# EAGLE design reprap_modular_electronics (EAGLE 5.11)
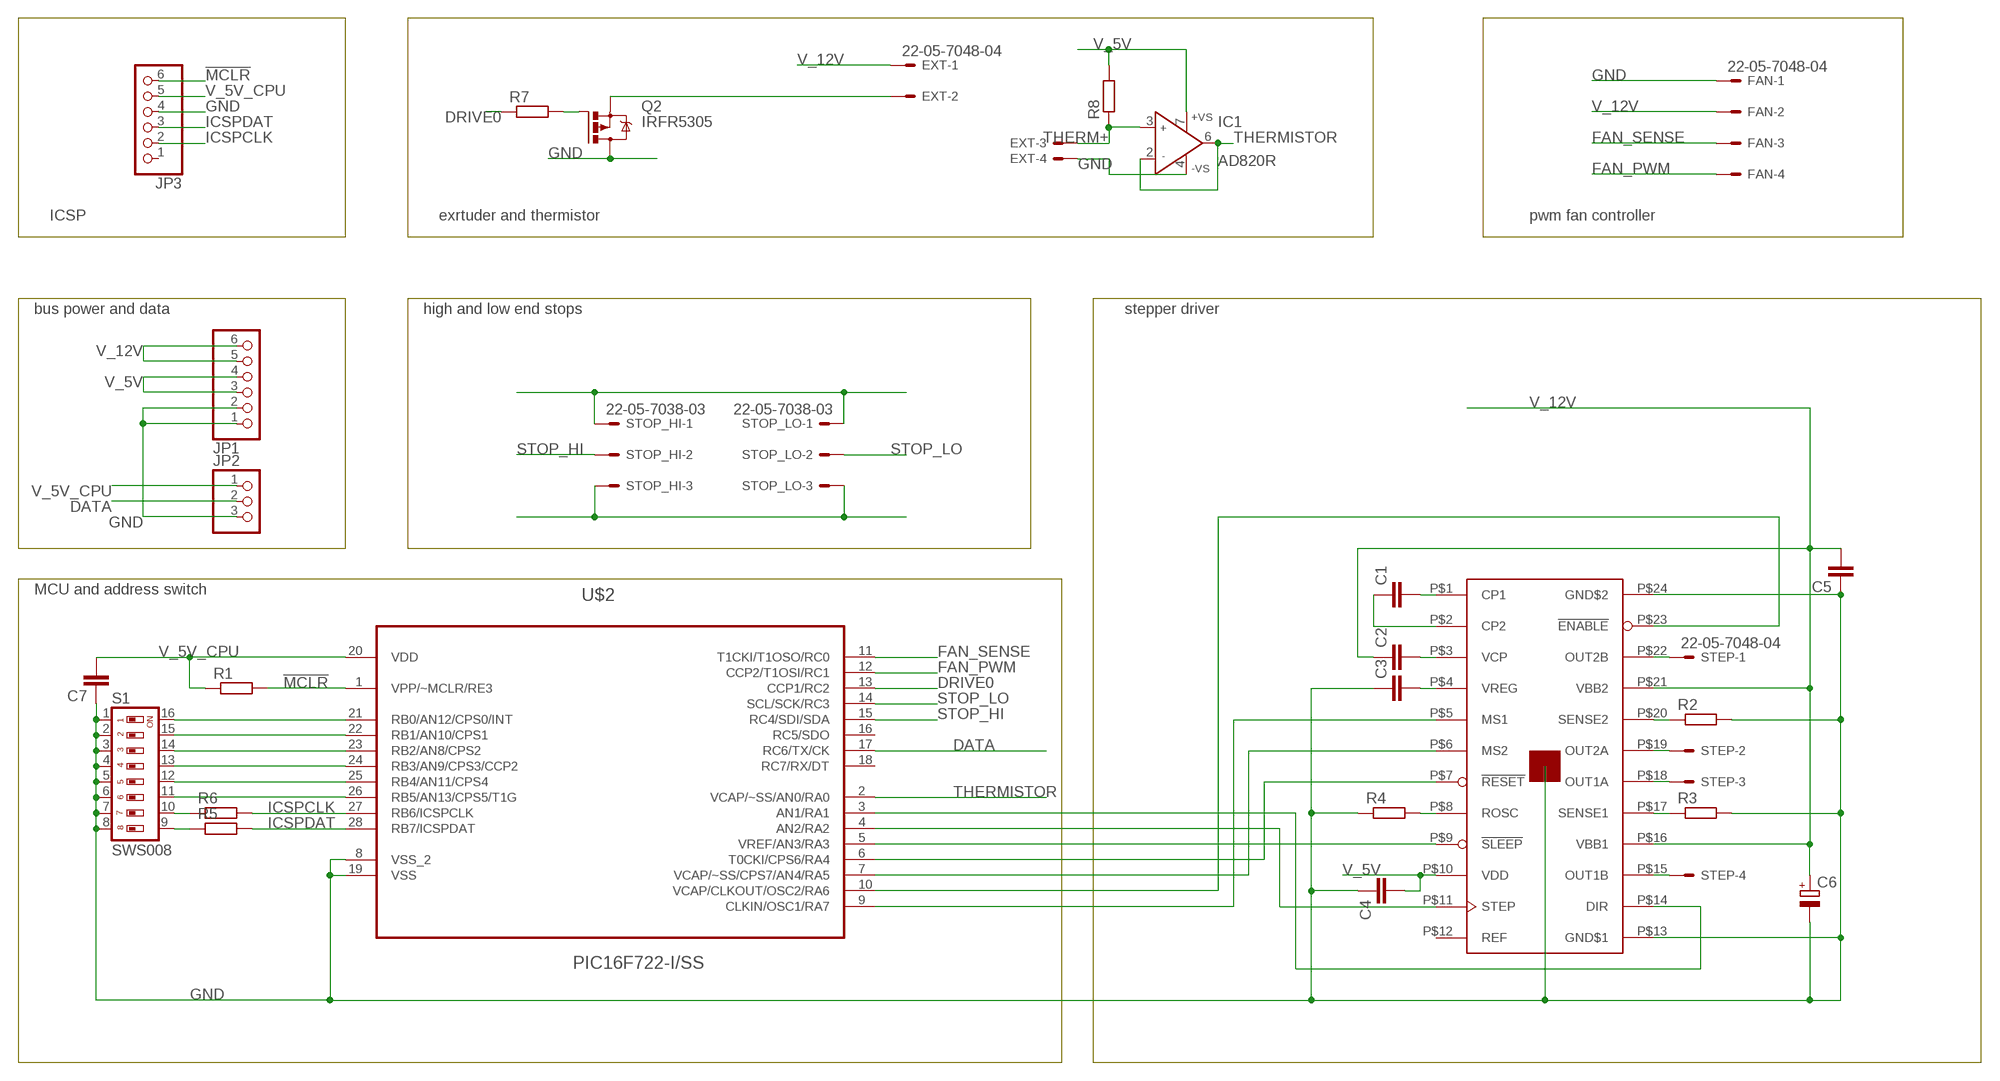
[diagram p0: schematic, sheet 1]

## Parts
C1  C-EUC0603K  [C0603K]
C2  C-EUC0603K  [C0603K]
C3  C-EUC0603K  [C0603K]
C4  C-EUC0603K  [C0603K]
C5  C-EUC0603K  [C0603K]
C6  CPOL-EU153CLV-0505  [153CLV-0505]
C7  C-EUC0603K  [C0603K]
EXT  22-05-7048-04  [7395-04]
FAN  22-05-7048-04  [7395-04]
IC1  AD820R  [SO8]
JP1  PINHD-1X6/90  [1X06/90]
JP2  PINHD-1X3/90  [1X03/90]
JP3  PINHD-1X6/90  [1X06/90]
Q2  IRFR5305  [D-PAK_TO252AA]
R1  R-EU_R0603  [R0603]
R2  R-EU_R0805  [R0805]
R3  R-EU_R0805  [R0805]
R4  R-EU_R0603  [R0603]
R5  R-EU_R0603  [R0603]
R6  R-EU_R0603  [R0603]
R7  R-EU_R0603  [R0603]
R8  R-EU_R0603  [R0603]
S1  SWS008  [SMS-008]
STEP  22-05-7048-04  [7395-04]
STOP_HI  22-05-7038-03  [7395-03]
STOP_LO  22-05-7038-03  [7395-03]
U$1  A4982  [TSSOP24]
U$2  PIC16F722-I/SS  [SOP65P780X200-28N]

## Nets
!ENABLE: U$1.P$23(!ENABLE) U$2.10(VCAP/CLKOUT/OSC2/RA6)
!MCLR: JP3.6 R1.2 U$2.1(VPP/~MCLR/RE3)
!RESET: U$1.P$7(!RESET) U$2.6(T0CKI/CPS6/RA4)
!SLEEP: U$1.P$9(!SLEEP) U$2.5(VREF/AN3/RA3)
DATA: JP2.2 U$2.17(RC6/TX/CK)
DIR: U$1.P$14(DIR) U$2.3(AN1/RA1)
DRIVE0: R7.1 U$2.13(CCP1/RC2)
FAN_PWM: FAN.4 U$2.12(CCP2/T1OSI/RC1)
FAN_SENSE: FAN.3 U$2.11(T1CKI/T1OSO/RC0)
GND: C3.1 C4.1 C5.1 C6.- C7.1 EXT.4 FAN.1 IC1.4(-VS) JP1.1 JP1.2 JP2.3 JP3.4 Q2.4(D) R2.2 R3.2 R4.1 S1.1 S1.2 S1.3 S1.4 S1.5 S1.6 S1.7 S1.8 STOP_HI.3 STOP_LO.3 U$1.EP(GND$0) U$1.P$13(GND$1) U$1.P$24(GND$2) U$2.8(VSS_2) U$2.19(VSS)
ICSPCLK: JP3.2 R6.2 U$2.27(RB6/ICSPCLK)
ICSPDAT: JP3.3 R5.2 U$2.28(RB7/ICSPDAT)
MS2: U$1.P$6(MS2) U$2.7(VCAP/~SS/CPS7/AN4/RA5)
N$1: EXT.2 Q2.3(S)
N$2: U$1.P$5(MS1) U$2.9(CLKIN/OSC1/RA7)
N$8: STEP.1 U$1.P$22(OUT2B)
N$9: STEP.2 U$1.P$19(OUT2A)
N$10: STEP.3 U$1.P$18(OUT1A)
N$11: STEP.4 U$1.P$15(OUT1B)
N$12: R2.1 U$1.P$20(SENSE2)
N$13: R3.1 U$1.P$17(SENSE1)
N$14: C1.2 U$1.P$1(CP1)
N$15: C1.1 U$1.P$2(CP2)
N$16: C2.2 U$1.P$3(VCP)
N$17: C3.2 U$1.P$4(VREG)
N$18: R5.1 S1.9
N$19: R6.1 S1.10
N$20: R4.2 U$1.P$8(ROSC)
N$21: S1.16 U$2.21(RB0/AN12/CPS0/INT)
N$22: S1.15 U$2.22(RB1/AN10/CPS1)
N$23: S1.14 U$2.23(RB2/AN8/CPS2)
N$24: S1.13 U$2.24(RB3/AN9/CPS3/CCP2)
N$25: S1.12 U$2.25(RB4/AN11/CPS4)
N$26: S1.11 U$2.26(RB5/AN13/CPS5/T1G)
N$27: Q2.1(G) R7.2
STEP: U$1.P$11(STEP) U$2.4(AN2/RA2)
STOP_HI: STOP_HI.2 U$2.15(RC4/SDI/SDA)
STOP_LO: STOP_LO.2 U$2.14(SCL/SCK/RC3)
THERM+: EXT.3 IC1.3(IN+) R8.1
THERMISTOR: IC1.2(IN-) IC1.6(OUT) U$2.2(VCAP/~SS/AN0/RA0)
V_5V: C4.2 IC1.7(+VS) JP1.3 JP1.4 R8.2 STOP_HI.1 STOP_LO.1 U$1.P$10(VDD)
V_5V_CPU: C7.2 JP2.1 JP3.5 R1.1 U$2.20(VDD)
V_12V: C2.1 C5.2 C6.+ EXT.1 FAN.2 JP1.5 JP1.6 U$1.P$16(VBB1) U$1.P$21(VBB2)
Unconnected: JP3.1 U$1.P$12(REF) U$2.16(RC5/SDO) U$2.18(RC7/RX/DT)

## Notes on the sheet
- ICSP | exrtuder and thermistor | pwm fan controller
- bus power and data | high and low end stops | stepper driver
- MCU and address switch

## Library data of the parts
C1-C5 C7 = rcl:C-EU: CAPACITOR, European symbol
C6 = rcl:CPOL-EU: POLARIZED CAPACITOR, European symbol
EXT FAN STEP = con-molex:22-?-04: CONNECTOR wire to board 2.54 mm (.1 inch) pitch header; OC_FARNELL: unknown; OC_NEWARK: unknown
IC1 = analog-devices:AD820: Single-Supply, Rail-to-Rail, Low Power, FET Input Op Amp Source: http://www.analog.com/static/imported-files/data_sheets/AD820.pdf; OC_FARNELL: 1838867; OC_NEWARK: unknown
JP1 JP3 = pinhead:PINHD-1X6: PIN HEADER
JP2 = pinhead:PINHD-1X3: PIN HEADER
Q2 = transistor-power:IRF?5305: HEXFET Power MOSFET Source: http://www.irf.com/product-info/datasheets/data/irfr5305pbf.pdf
R1 R5-R8 = rcl:R-EU_: RESISTOR, European symbol
R2-R4 = resistor:R-EU_: RESISTOR, European symbol
S1 = smd-special:SWS008: SMD Dip Switch 8 pol.
STOP_HI STOP_LO = con-molex:22-?-03: CONNECTOR wire to board 2.54 mm (.1 inch) pitch header; OC_FARNELL: unknown; OC_NEWARK: unknown
U$1 = ics:A4982
U$2 = ics:PIC16F722-I/SS: 8-Bit CMOS Microcontrollers; MPN: PIC16F722-I/SS; OC_FARNELL: 1630147; OC_NEWARK: 54M4996; PACKAGE: SOP-28; SUPPLIER: Microchip

## Board
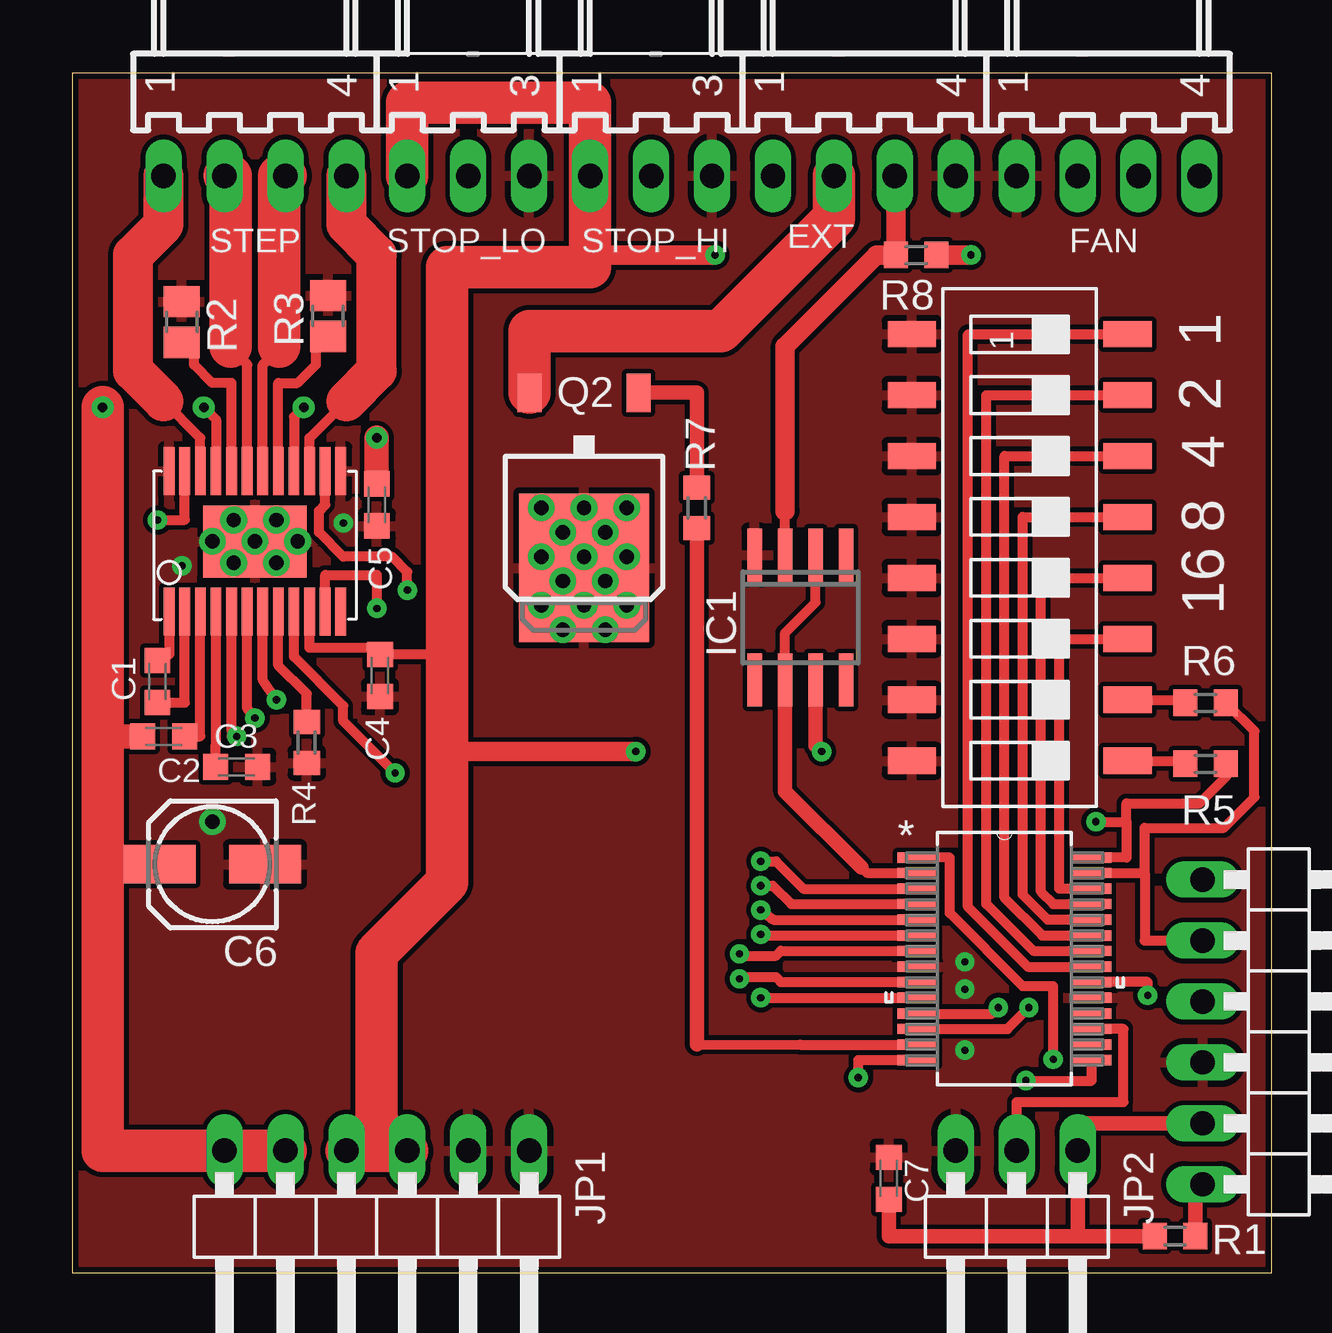
[diagram p1: board, top side]
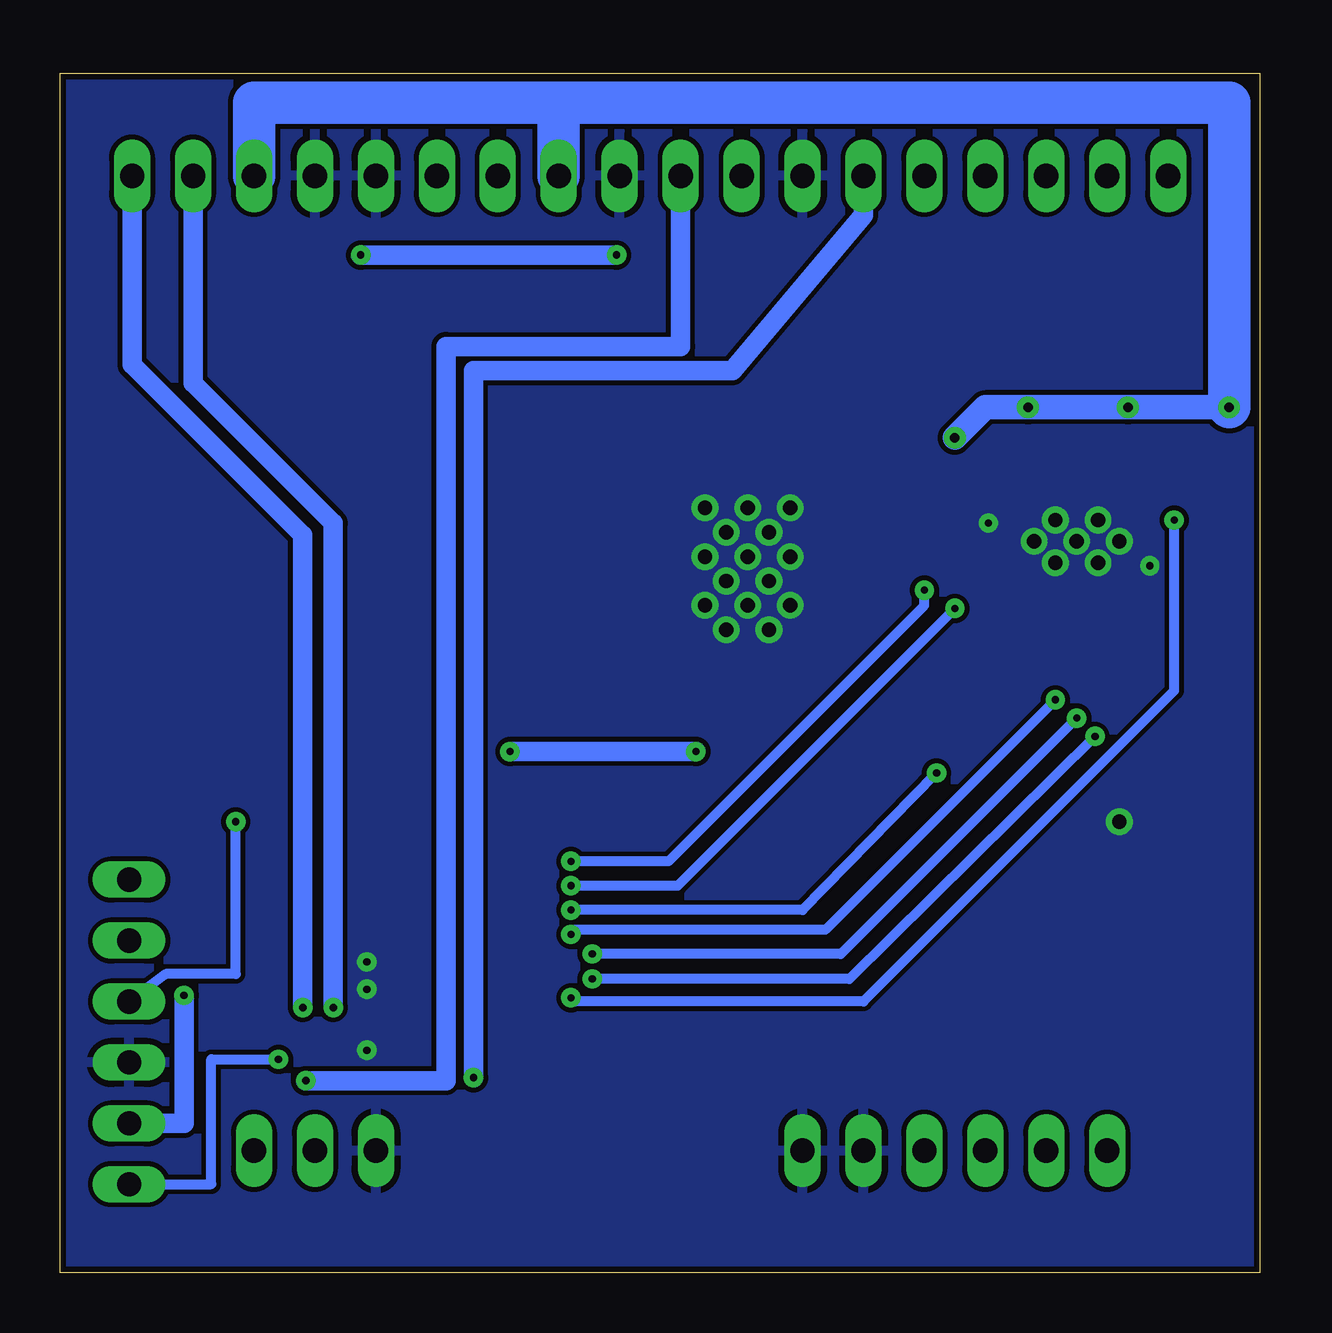
[diagram p2: board, bottom side, seen from below]

Size 50 x 50 mm. Coordinates in mm from the lower left corner, seen from the top.
Outline: 0,0 50,0 50,50 0,50 0,0
Copper layers (1*16): Top 0.035mm / dielectric 1.5mm / Bottom 0.035mm
Design rules "pcbtrain *": minimum track width 0.2mm, minimum drill 0.3mm, track to track 0.2mm, track to pad 0.2mm, pad to pad 0.2mm, via to via 0.2mm, smd to smd 0mil, copper to edge 10mil, drill to drill 0.2mm, minimum pad ring 10mil, minimum via ring 10mil, stop-mask expansion 0.125mm, vias tented up to drill 2mm, thermal gap 10mil

### Footprints (pad centres in the part's own frame; a part is rotated, then mirrored left to right if it is on the bottom)
C0603K = smd 1.05 x 1.08: 1 -0.875,0; 2 0.875,0
153CLV-0505 = smd 3 x 1.6: + 2.2,0; - -2.2,0
7395-04 = drill 1.016 long: 1 3.81,0; 2 1.27,0; 3 -1.27,0; 4 -3.81,0
SO8 = smd 0.6 x 2.2: 1 -1.905,-2.6; 2 -0.635,-2.6; 3 0.635,-2.6; 4 1.905,-2.6; 5 1.905,2.6; 6 0.635,2.6; 7 -0.635,2.6; 8 -1.905,2.6
1X06/90 = drill 1.016 long: 1 -6.35,-3.81; 2 -3.81,-3.81; 3 -1.27,-3.81; 4 1.27,-3.81; 5 3.81,-3.81; 6 6.35,-3.81
1X03/90 = drill 1.016 long: 1 -2.54,-3.81; 2 0,-3.81; 3 2.54,-3.81
D-PAK_TO252AA = smd 1 x 1.6: 1 -2.28,-4.8; 3 2.28,-4.8 | smd 5.4 x 6.2: 4 0,2.5
R0603 = smd 1 x 1.1: 1 -0.85,0; 2 0.85,0
R0805 = smd 1.3 x 1.5: 1 -0.85,0; 2 0.85,0
SMS-008 = smd 1.092 x 2.007: 1 -8.89,-4.496; 2 -6.35,-4.496; 3 -3.81,-4.496; 4 -1.27,-4.496; 5 1.27,-4.496; 6 3.81,-4.496; 7 6.35,-4.496; 8 8.89,-4.496; 9 8.89,4.496; 10 6.35,4.496; 11 3.81,4.496; 12 1.27,4.496; 13 -1.27,4.496; 14 -3.81,4.496; 15 -6.35,4.496; 16 -8.89,4.496
7395-03 = drill 1.016 long: 1 2.54,0; 2 0,0; 3 -2.54,0
TSSOP24 = smd 4.32 x 3: EP 0,0 | smd 0.45 x 2: P$1 -3.575,-2.925; P$2 -2.925,-2.925; P$3 -2.275,-2.925; P$4 -1.625,-2.925; P$5 -0.975,-2.925; P$6 -0.325,-2.925; P$7 0.325,-2.925; P$8 0.975,-2.925; P$9 1.625,-2.925; P$10 2.275,-2.925; P$11 2.925,-2.925; P$12 3.575,-2.925; P$13 3.575,2.925; P$14 2.925,2.925; P$15 2.275,2.925; P$16 1.625,2.925; P$17 0.975,2.925; P$18 0.325,2.925; P$19 -0.325,2.925; P$20 -0.975,2.925; P$21 -1.625,2.925; P$22 -2.275,2.925; P$23 -2.925,2.925; P$24 -3.575,2.925
SOP65P780X200-28N = smd 1.651 x 0.432: 1 -3.632,4.216; 2 -3.632,3.581; 3 -3.632,2.921; 4 -3.632,2.286; 5 -3.632,1.626; 6 -3.632,0.965; 7 -3.632,0.33; 8 -3.632,-0.33; 9 -3.632,-0.965; 10 -3.632,-1.626; 11 -3.632,-2.286; 12 -3.632,-2.921; 13 -3.632,-3.581; 14 -3.632,-4.216; 15 3.632,-4.216; 16 3.632,-3.581; 17 3.632,-2.921; 18 3.632,-2.286; 19 3.632,-1.626; 20 3.632,-0.965; 21 3.632,-0.33; 22 3.632,0.33; 23 3.632,0.965; 24 3.632,1.626; 25 3.632,2.286; 26 3.632,2.921; 27 3.632,3.581; 28 3.632,4.216

### Placement (x,y rotation side)
C1  3.56,24.64 90 top
C2  3.81,22.35 0 top
C3  6.86,21.08 180 top
C4  12.83,24.89 90 top
C5  12.7,32 90 top
C6  5.84,17.02 180 top
C7  34.04,3.94 270 top
EXT  33.02,45.72 180 top
FAN  43.18,45.72 180 top
IC1  30.35,27.3 180 top
JP1  12.7,1.27 180 top
JP2  39.37,1.27 180 top
JP3  50.93,10.03 270 top
Q2  21.34,31.88 180 top
R1  45.97,1.52 0 top
R2  4.57,39.62 90 top
R3  10.67,39.88 90 top
R4  9.78,22.1 90 top
R5  47.24,21.21 0 top
R6  47.24,23.75 0 top
R7  26.04,31.88 90 top
R8  35.18,42.42 0 top
S1  39.5,30.23 270 top
STEP  7.62,45.72 180 top
STOP_HI  24.13,45.72 180 top
STOP_LO  16.51,45.72 180 top
U$1  7.62,30.48 0 top
U$2  38.86,13.08 0 top

### Tracks (layer width: path | path; a pad name or v marks a point on that pad's centre or on a via)
!ENABLE  (via drill 0.3 pad 0.25)
  Top 0.406: U$1.P$23 4.7,31.37 v3.56,31.37 | v28.7,11.46 U$2.10
  Bottom 0.406: v28.7,11.46 28.55,11.3 16.51,11.3 3.56,24.26 v3.56,31.37
!MCLR  (via drill 0.3 pad 0.25)
  Top 0.406: U$2.1 36.58,17.3 36.58,14.99 39.62,11.94 40.89,11.94 v40.89,8.89
  Top 0.61: JP3.6 46.82,3.68 R1.2
  Bottom 0.406: v40.89,8.89 43.69,8.89 43.69,3.68 JP3.6
!RESET  (via drill 0.3 pad 0.25)
  Top 0.406: U$1.P$7 7.95,24.69 v8.51,23.88 | v28.7,14.1 28.75,14.05 U$2.6
  Bottom 0.406: v8.51,23.88 18.1,14.29 28.51,14.29 v28.7,14.1
!SLEEP  (via drill 0.3 pad 0.25)
  Top 0.406: U$1.P$9 9.24,25.68 11.3,23.62 11.3,22.99 v13.46,20.83 | v28.7,15.11 29.23,14.71 U$2.5
  Bottom 0.406: v13.46,20.83 19.05,15.11 v28.7,15.11
DATA
  Top 0.406: JP2.2 39.37,7.11 43.81,7.11 43.81,10.16 U$2.17
DIR  (via drill 0.3 pad 0.25)
  Top 0.406: U$1.P$14 10.54,32.01 10.29,31.75 10.29,30.86 11.3,29.84 13.34,29.84 13.97,29.21 v13.97,28.45 | v28.7,17.14 29.34,17.14 30.48,16 U$2.3
  Bottom 0.406: v13.97,28.45 13.97,27.81 24.64,17.14 v28.7,17.14
DRIVE0
  Top 0.406: 26.04,9.53 30.35,9.5 U$2.13
  Top 0.61: 26.04,9.53 R7.1
FAN_PWM  (via drill 0.3 pad 0.25)
  Top 0.406: U$2.12 38.99,10.16 v39.88,11.05
  Bottom 0.813: v39.88,11.05 39.88,30.73 46.99,37.85 FAN.4
FAN_SENSE  (via drill 0.3 pad 0.25)
  Top 0.406: U$2.11 38.35,10.79 v38.61,11.05
  Bottom 0.813: v38.61,11.05 38.61,31.24 44.45,37.08 FAN.3
GND  (via drill 0.3 pad 0.25, 0.6 pad 0.25)
  other vias: 7.62,30.48 6.73,31.37 8.51,31.37 8.51,29.59 9.4,30.48 5.84,30.48 6.73,29.59 5.84,18.8 37.21,11.81 37.21,9.27 37.21,12.95 11.3,31.24 4.57,29.46 21.34,31.88 20.45,30.86 22.23,30.86 21.34,29.84 20.45,28.83 22.23,28.83 23.11,29.84 23.11,31.88 19.56,31.88 19.56,29.84 19.56,27.81 21.34,27.81 23.11,27.81 22.23,26.8 20.45,26.8
  pour Bottom (rank 6): 0,50 50,50 50,0 0,0
  pour Top (rank 2): 0,0 50,0 50,50 0,50
ICSPCLK
  Top 0.406: R6.2 49.28,22.57 49.28,19.81 48.01,18.54 44.7,18.54 44.7,16.66 | U$2.27 44.7,16.66 | JP3.2 44.7,13.84 44.7,16.66
ICSPDAT  (via drill 0.3 pad 0.25)
  Top 0.406: R5.2 48.09,20.66 46.99,19.56 43.94,19.56 43.94,18.8 | U$2.28 43.94,17.3 43.94,18.8 | v42.67,18.8 43.94,18.8
  Bottom 0.406: v42.67,18.8 42.67,12.45 45.59,12.45 JP3.3
MS2  (via drill 0.3 pad 0.25)
  Top 0.406: U$1.P$6 7.29,23.5 v7.62,23.11 | U$2.7 29.54,13.41 29.34,13.21 27.89,13.21 v27.81,13.28
  Bottom 0.406: v27.81,13.28 17.45,13.28 v7.62,23.11
N$1
  Top 1.778: Q2.3 19.06,39.24 27.05,39.24 31.75,43.94 EXT.2
N$2  (via drill 0.3 pad 0.25)
  Top 0.406: 6.64,22.61 6.64,22.35 | 6.64,22.61 U$1.P$5 | v6.86,22.35 6.86,22.39 6.64,22.61 | U$2.9 29.54,12.12 29.34,12.32 27.89,12.32 v27.81,12.24
  Bottom 0.406: v27.81,12.24 17.09,12.24 v6.86,22.35
N$8
  Top 0.406: U$1.P$22 5.34,34.79 3.81,36.32
  Top 1.676: 3.81,36.32 2.54,37.59 2.54,42.42 3.81,43.69 STEP.1
N$9
  Top 0.406: U$1.P$19 7.29,37.85 6.6,38.61
  Top 1.778: STEP.2 6.6,45.72 6.6,38.61
N$10
  Top 0.406: U$1.P$18 7.95,37.85 8.64,38.61
  Top 1.778: STEP.3 8.64,45.72 8.64,38.61
N$11
  Top 0.406: U$1.P$15 9.89,34.79 11.43,36.32
  Top 1.676: 11.43,36.32 12.7,37.59 12.7,42.42 11.43,43.69 STEP.4
N$12
  Top 0.406: U$1.P$20 6.64,37.08 5.84,37.08 5.08,37.85 5.08,38.77 R2.1
N$13
  Top 0.406: U$1.P$17 8.6,37.08 9.4,37.08 10.16,37.85 10.16,39.03 R3.1
N$14
  Top 0.406: U$1.P$1 4.04,25.77 C1.2
N$15
  Top 0.406: C1.1 4.7,23.76 U$1.P$2
N$16
  Top 0.406: U$1.P$3 5.34,22.35 C2.2
N$17
  Top 0.406: U$1.P$4 6,22.97 C3.2
N$18
  Top 0.406: S1.9 46.39,21.34 R5.1
N$19
  Top 0.406: S1.10 46.39,23.88 R6.1
N$20
  Top 0.406: U$1.P$8 8.6,25.31 9.78,24.13 R4.2
N$21
  Top 0.406: S1.16 37.34,39.12 37.34,15.24 39.83,12.75 U$2.21
N$22
  Top 0.406: S1.15 38.1,36.58 38.1,15.37 40.06,13.41 U$2.22
N$23
  Top 0.406: S1.14 38.86,34.04 38.86,15.62 40.44,14.05 U$2.23
N$24
  Top 0.406: S1.13 39.62,31.5 39.62,15.75 40.66,14.71 U$2.24
N$25
  Top 0.406: S1.12 40.39,28.96 40.39,15.88 40.89,15.37 U$2.25
N$26
  Top 0.406: S1.11 41.15,26.42 41.15,16 U$2.26
N$27
  Top 0.61: Q2.1 26.04,36.68 R7.2
STEP  (via drill 0.3 pad 0.25)
  Top 0.406: U$1.P$11 10.54,29.08 12.7,29.08 v12.7,27.69 | v28.7,16.13 29.21,16.13 29.97,15.37 U$2.4
  Bottom 0.406: v12.7,27.69 24.26,16.13 v28.7,16.13
STOP_HI  (via drill 0.3 pad 0.25)
  Top 0.406: v39.75,8 42.49,8 U$2.15
  Bottom 0.813: STOP_HI.2 24.13,38.61 33.91,38.61 33.91,8 v39.75,8
STOP_LO  (via drill 0.3 pad 0.25)
  Top 0.406: v32.77,8.13 32.77,8.87 U$2.14
  Bottom 0.813: v32.77,8.13 32.77,37.59 21.97,37.59 16.51,44.07 STOP_LO.2
THERM+
  Top 0.406: IC1.3 29.72,31.75
  Top 0.813: EXT.3 34.33,45.68 R8.1 33.53,42.42 29.72,38.61 29.72,31.75
THERMISTOR
  Top 0.406: U$2.2 33.12,16.66 32.89,16.89 | IC1.6 29.72,26.67 30.99,27.94 IC1.2
  Top 0.61: IC1.6 29.72,20.07 32.89,16.89
V_5V  (via drill 0.3 pad 0.25)
  Top 0.406: U$1.P$10 9.89,26.05 12.42,26.05 C4.2 15.48,25.77 15.62,25.91
  Top 0.61: IC1.7 30.99,21.97 v31.24,21.72
  Top 0.813: v37.47,42.42 R8.2 | v26.8,42.42 21.72,42.42 21.59,42.55 | v23.5,21.72 15.88,21.72 15.62,21.46
  Top 1.778: STOP_LO.1 13.97,48.77 21.59,48.77 STOP_HI.1 21.59,42.55 21.59,41.91 15.62,41.91 15.62,25.91 15.62,21.46 15.62,16.26 12.7,13.34 12.7,5.08 | JP1.4 12.7,5.08 | 12.7,5.08 JP1.3
  Bottom 0.813: v26.8,42.42 v37.47,42.42 | v23.5,21.72 v31.24,21.72
V_5V_CPU  (via drill 0.3 pad 0.25)
  Top 0.406: U$2.20 44.83,12.12 v44.83,11.56
  Top 0.61: JP3.5 41.91,6.22 JP2.1 41.91,1.52 | 41.91,1.52 R1.1 | C7.2 34.04,1.52 41.91,1.52
  Bottom 0.813: v44.83,11.56 44.83,6.22 JP3.5
V_12V  (via drill 0.4)
  Top 0.406: U$1.P$21 6,35.56 v5.49,36.07 | U$1.P$16 9.24,35.66 v9.65,36.07
  Top 1.016: 1.27,22.35 C2.1 | 1.27,17.02 C6.+ | v12.7,34.8 C5.2
  Top 1.778: v1.27,36.07 1.27,22.35 1.27,17.02 1.27,5.08 JP1.6 JP1.5
  Bottom 1.016: v12.7,34.8 11.43,36.07 v9.65,36.07 v5.49,36.07 v1.27,36.07
  Bottom 1.778: v1.27,36.07 1.27,48.77 29.21,48.77 | FAN.2 41.91,48.77 29.21,48.77 | 29.21,48.77 EXT.1

### Text on the board
tNames: 1 | 2 | 4 | 8 | 16